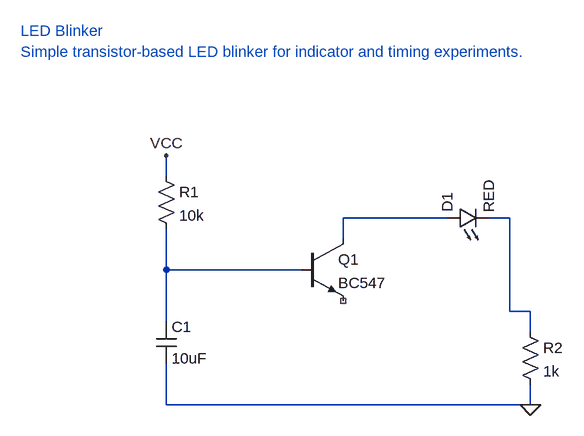
[diagram p0: schematic led_blinker.asc]
led_blinker.asc, the LTspice schematic file:
Version 4
SHEET 1 1200 800
TEXT 16 16 Left 2 ;LED Blinker
TEXT 16 48 Left 2 ;Simple transistor-based LED blinker for indicator and timing experiments.
SYMBOL npn 448 336 R0
SYMATTR InstName Q1
SYMATTR Value BC547
SYMBOL res 224 224 R0
SYMATTR InstName R1
SYMATTR Value 10k
SYMBOL res 784 464 R0
SYMATTR InstName R2
SYMATTR Value 1k
SYMBOL cap 224 464 R0
SYMATTR InstName C1
SYMATTR Value 10uF
SYMBOL led 672 320 R270
SYMATTR InstName D1
SYMATTR Value RED
FLAG 240 208 VCC
WIRE 240 208 240 240
WIRE 240 320 240 352
WIRE 240 352 240 384
WIRE 240 384 240 432
WIRE 240 384 416 384
WIRE 240 432 240 464
WIRE 416 384 448 384
WIRE 512 304 512 336
WIRE 512 304 640 304
WIRE 640 304 672 304
WIRE 736 304 768 304
WIRE 768 304 768 448
WIRE 768 448 800 448
WIRE 800 448 800 480
FLAG 800 592 0
WIRE 240 528 240 560
WIRE 240 560 240 592
WIRE 240 592 800 592
WIRE 800 560 800 592

The netlist it stands for:
* led_blinker.asc
Q1 N002 N001 NC_01 0 BC547
R1 VCC N001 10k
R2 N003 0 1k
C1 N001 0 10uF
D1 N002 N003 RED
.model D D
.lib standard.dio
.model NPN NPN
.model PNP PNP
.lib standard.bjt
* LED Blinker
* Simple transistor-based LED blinker for indicator and timing experiments.
.backanno
.end